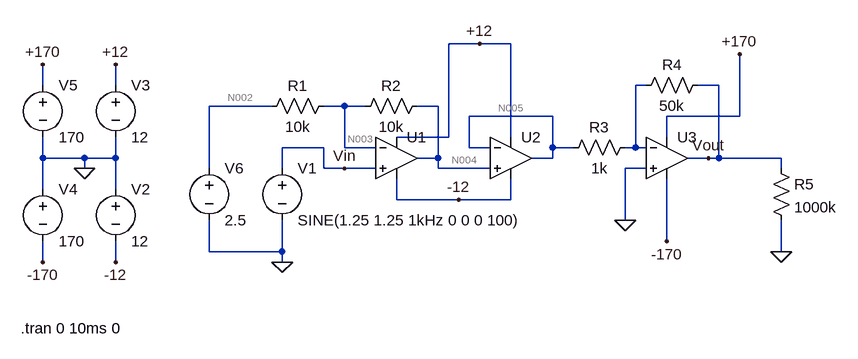
[diagram p0: schematic eom_driver_sim.asc]
eom_driver_sim.asc, the LTspice schematic file:
Version 4
SHEET 1 1120 680
WIRE 560 -160 512 -160
WIRE 608 -160 560 -160
WIRE -112 -96 -112 -128
WIRE 0 -96 0 -128
WIRE 816 -96 800 -96
WIRE 928 -96 896 -96
WIRE 240 -64 144 -64
WIRE 352 -64 320 -64
WIRE 384 -64 352 -64
WIRE 496 -64 464 -64
WIRE 672 -48 544 -48
WIRE 960 -48 960 -144
WIRE 960 -48 848 -48
WIRE 512 -16 512 -160
WIRE 512 -16 432 -16
WIRE 608 -16 608 -160
WIRE 848 -16 848 -48
WIRE 320 0 256 0
WIRE 352 0 352 -64
WIRE 400 0 352 0
WIRE 544 0 544 -48
WIRE 576 0 544 0
WIRE 672 0 672 -48
WIRE 704 0 672 0
WIRE 800 0 800 -96
WIRE 800 0 784 0
WIRE 816 0 800 0
WIRE -112 16 -112 -16
WIRE -48 16 -112 16
WIRE 0 16 0 -16
WIRE 0 16 -48 16
WIRE 496 16 496 -64
WIRE 496 16 464 16
WIRE 672 16 672 0
WIRE 672 16 640 16
WIRE 912 16 880 16
WIRE 928 16 928 -96
WIRE 928 16 912 16
WIRE 1024 16 928 16
WIRE -48 32 -48 16
WIRE 144 32 144 -64
WIRE 256 32 256 0
WIRE 320 32 320 0
WIRE 352 32 320 32
WIRE 400 32 352 32
WIRE 496 32 496 16
WIRE 576 32 496 32
WIRE 816 32 784 32
WIRE 1024 32 1024 16
WIRE -112 64 -112 16
WIRE 0 64 0 16
WIRE 432 80 432 48
WIRE 528 80 432 80
WIRE 608 80 608 48
WIRE 608 80 528 80
WIRE 784 112 784 32
WIRE 848 144 848 48
WIRE 144 160 144 112
WIRE 256 160 256 112
WIRE 256 160 144 160
WIRE 1024 160 1024 112
WIRE -112 176 -112 144
WIRE 0 176 0 144
WIRE 256 176 256 160
FLAG -48 32 0
FLAG 0 -128 +12
FLAG 0 176 -12
FLAG -112 -128 +170
FLAG -112 176 -170
FLAG 256 176 0
FLAG 560 -160 +12
FLAG 528 80 -12
FLAG 352 32 Vin
FLAG 912 16 Vout
FLAG 960 -144 +170
FLAG 848 144 -170
FLAG 1024 160 0
FLAG 784 112 0
SYMBOL voltage 256 16 R0
WINDOW 123 0 0 Left 0
WINDOW 39 0 0 Left 0
SYMATTR InstName V1
SYMATTR Value SINE(1.25 1.25 1kHz 0 0 0 100)
SYMBOL voltage 0 48 R0
WINDOW 123 0 0 Left 0
WINDOW 39 0 0 Left 0
SYMATTR InstName V2
SYMATTR Value 12
SYMBOL voltage 0 -112 R0
WINDOW 123 0 0 Left 0
WINDOW 39 0 0 Left 0
SYMATTR InstName V3
SYMATTR Value 12
SYMBOL voltage -112 48 R0
WINDOW 123 0 0 Left 0
WINDOW 39 0 0 Left 0
SYMATTR InstName V4
SYMATTR Value 170
SYMBOL voltage -112 -112 R0
WINDOW 123 0 0 Left 0
WINDOW 39 0 0 Left 0
SYMATTR InstName V5
SYMATTR Value 170
SYMBOL Opamps\\UniversalOpamp2 432 16 R0
SYMATTR InstName U1
SYMBOL Opamps\\UniversalOpamp2 608 16 R0
SYMATTR InstName U2
SYMBOL Opamps\\UniversalOpamp2 848 16 R0
SYMATTR InstName U3
SYMBOL voltage 144 16 R0
WINDOW 123 0 0 Left 0
WINDOW 39 0 0 Left 0
SYMATTR InstName V6
SYMATTR Value 2.5
SYMBOL res 336 -80 R90
WINDOW 0 0 56 VBottom 2
WINDOW 3 32 56 VTop 2
SYMATTR InstName R1
SYMATTR Value 10k
SYMBOL res 480 -80 R90
WINDOW 0 0 56 VBottom 2
WINDOW 3 32 56 VTop 2
SYMATTR InstName R2
SYMATTR Value 10k
SYMBOL res 800 -16 R90
WINDOW 0 0 56 VBottom 2
WINDOW 3 32 56 VTop 2
SYMATTR InstName R3
SYMATTR Value 1k
SYMBOL res 912 -112 R90
WINDOW 0 0 56 VBottom 2
WINDOW 3 32 56 VTop 2
SYMATTR InstName R4
SYMATTR Value 50k
SYMBOL res 1008 16 R0
SYMATTR InstName R5
SYMATTR Value 1000k
TEXT -146 278 Left 2 !.tran 0 10ms 0

The netlist it stands for:
* eom_driver_sim.asc
V1 Vin 0 SINE(1.25 1.25 1kHz 0 0 0 100)
V2 0 -12 12
V3 +12 0 12
V4 0 -170 170
V5 +170 0 170
XU1 Vin N003 +12 -12 N004 level.2 Avol=1Meg GBW=10Meg Slew=10Meg ilimit=25m rail=0 Vos=0 phimargin=45 en=0 enk=0 in=0 ink=0 Rin=500Meg  ; pins IN+ IN- V+ V- OUT
XU2 N004 N005 +12 -12 N005 level.2 Avol=1Meg GBW=10Meg Slew=10Meg ilimit=25m rail=0 Vos=0 phimargin=45 en=0 enk=0 in=0 ink=0 Rin=500Meg  ; pins IN+ IN- V+ V- OUT
XU3 0 N001 +170 -170 Vout level.2 Avol=1Meg GBW=10Meg Slew=10Meg ilimit=25m rail=0 Vos=0 phimargin=45 en=0 enk=0 in=0 ink=0 Rin=500Meg  ; pins IN+ IN- V+ V- OUT
V6 N002 0 2.5
R1 N003 N002 10k
R2 N004 N003 10k
R3 N001 N005 1k
R4 Vout N001 50k
R5 Vout 0 1000k
.tran 0 10ms 0
.lib UniversalOpamps2.sub
.backanno
.end

* Results of the author's LTspice run, read from the files saved beside the schematic
* Operating Point, zero values left out:
*   V(vin) = 1.25 V
*   V(-12) = -12 V
*   V(+12) = 12 V
*   V(-170) = -170 V
*   V(+170) = 170 V
*   V(n004) = 25 µV
*   V(n003) = 1.25 V
*   V(n005) = 25 µV
*   V(vout) = -1.25 mV
*   V(n002) = 2.5 V
*   I(R5) = -1.25 nA
*   I(R4) = -25 nA
*   I(R3) = -25 nA
*   I(R2) = -125 µA
*   I(R1) = -125 µA
*   I(V6) = -125 µA
*   I(V5) = -14.79 mA
*   I(V4) = -14.79 mA
*   I(V3) = -2.337 mA
*   I(V2) = -2.462 mA
*   I(V1) = -2.5 nA
*   Ix(u1:1) = 2.5 nA
*   Ix(u1:2) = 2.5 nA
*   Ix(u1:3) = 1.138 mA
*   Ix(u1:4) = -1.263 mA
*   Ix(u1:5) = 125 µA
*   Ix(u2:3) = 1.199 mA
*   Ix(u2:4) = -1.199 mA
*   Ix(u2:5) = -25 nA
*   Ix(u3:3) = 14.79 mA
*   Ix(u3:4) = -14.79 mA
*   Ix(u3:5) = 26.25 nA
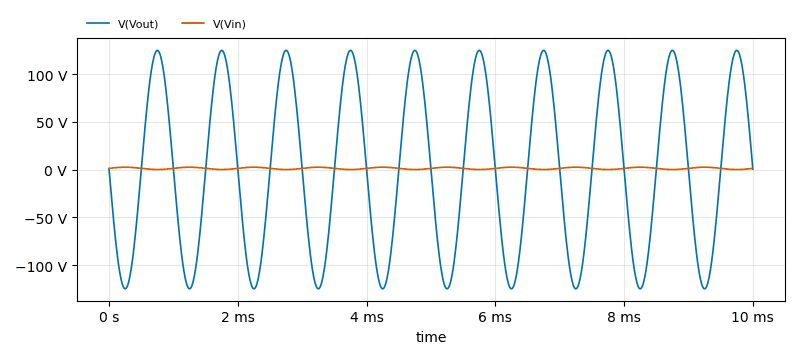
[diagram p1: Transient Analysis of eom_driver_sim.asc, plotted from the saved traces]
* Transient Analysis, 1 run:
*   V(Vout): min -124.9 V, max 124.9 V, average -1.319 mV, rms 88.32 V, last 675.3 mV
*   V(Vin): min 18.76 µV, max 2.5 V, average 1.25 V, rms 1.531 V, last 1.25 V